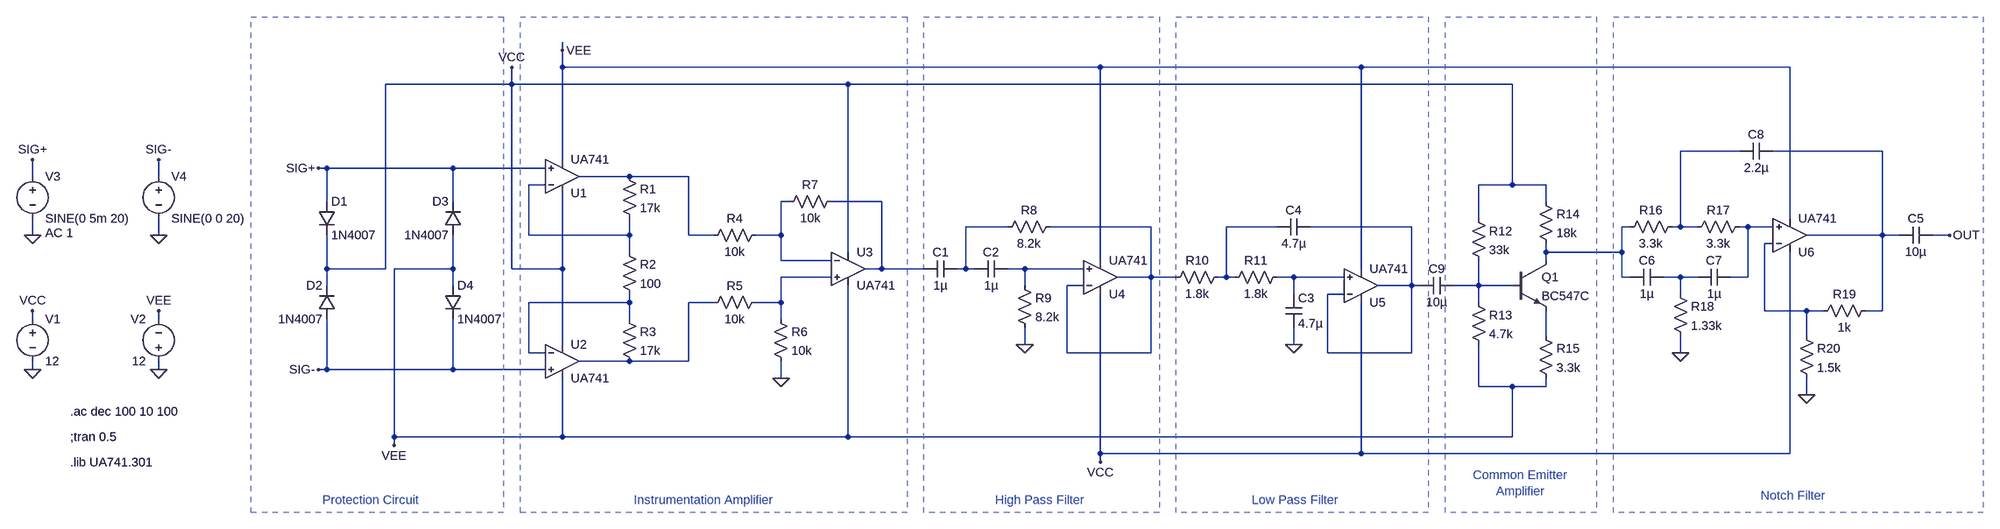
[diagram p0: schematic EEG_Final.asc]
EEG_Final.asc, the LTspice schematic file:
Version 4
SHEET 1 2916 756
WIRE 96 -128 96 -144
WIRE 96 -96 96 -128
WIRE 1120 -96 96 -96
WIRE 1616 -96 1120 -96
WIRE 2432 -96 1616 -96
WIRE 0 -64 0 -96
WIRE 0 -64 -240 -64
WIRE 640 -64 0 -64
WIRE 1904 -64 640 -64
WIRE 2336 64 2224 64
WIRE 2608 64 2400 64
WIRE 96 80 96 -96
WIRE -352 96 -368 96
WIRE -112 96 -352 96
WIRE 64 96 -112 96
WIRE -912 112 -912 80
WIRE -672 112 -672 80
WIRE 224 112 128 112
WIRE 336 112 224 112
WIRE 64 128 32 128
WIRE 1904 128 1904 -64
WIRE 1904 128 1840 128
WIRE 1968 128 1904 128
WIRE -352 160 -352 96
WIRE -112 160 -112 96
WIRE 528 160 512 160
WIRE 704 160 608 160
WIRE 1968 160 1968 128
WIRE 1840 192 1840 128
WIRE 2432 192 2432 -96
WIRE 944 208 864 208
WIRE 1216 208 1024 208
WIRE 1456 208 1360 208
WIRE 1712 208 1520 208
WIRE 2128 208 2112 208
WIRE 2224 208 2224 64
WIRE 2224 208 2208 208
WIRE 2256 208 2224 208
WIRE 2352 208 2336 208
WIRE 2400 208 2352 208
WIRE -912 224 -912 192
WIRE -672 224 -672 192
WIRE 32 224 32 128
WIRE 224 224 224 192
WIRE 224 224 32 224
WIRE 336 224 336 112
WIRE 384 224 336 224
WIRE 512 224 512 160
WIRE 512 224 464 224
WIRE 2608 224 2608 64
WIRE 2608 224 2464 224
WIRE 2640 224 2608 224
WIRE 2736 224 2704 224
WIRE 2400 240 2384 240
WIRE 224 256 224 224
WIRE 640 256 640 -64
WIRE 1968 256 1968 240
WIRE 2112 256 2112 208
WIRE 2112 256 1968 256
WIRE 512 272 512 224
WIRE 608 272 512 272
WIRE 1120 272 1120 -96
WIRE 1968 272 1968 256
WIRE -352 288 -352 224
WIRE -240 288 -240 -64
WIRE -240 288 -352 288
WIRE -112 288 -112 224
WIRE -112 288 -224 288
WIRE 0 288 0 -64
WIRE 96 288 96 144
WIRE 96 288 0 288
WIRE 704 288 704 160
WIRE 704 288 672 288
WIRE 784 288 704 288
WIRE 864 288 864 208
WIRE 864 288 848 288
WIRE 880 288 864 288
WIRE 976 288 944 288
WIRE 1088 288 976 288
WIRE 1616 288 1616 -96
WIRE 608 304 512 304
WIRE 1216 304 1216 208
WIRE 1216 304 1152 304
WIRE 1264 304 1216 304
WIRE 1360 304 1360 208
WIRE 1360 304 1344 304
WIRE 1376 304 1360 304
WIRE 1488 304 1456 304
WIRE 1584 304 1488 304
WIRE 2112 304 2112 256
WIRE 2128 304 2112 304
WIRE 2224 304 2192 304
WIRE 2256 304 2224 304
WIRE 2352 304 2352 208
WIRE 2352 304 2320 304
WIRE -352 320 -352 288
WIRE -112 320 -112 288
WIRE 976 320 976 288
WIRE 1088 320 1056 320
WIRE 1712 320 1712 208
WIRE 1712 320 1648 320
WIRE 1728 320 1712 320
WIRE 1840 320 1840 272
WIRE 1840 320 1792 320
WIRE 1904 320 1840 320
WIRE 1488 336 1488 304
WIRE 1584 336 1552 336
WIRE 2224 336 2224 304
WIRE 224 352 224 336
WIRE 224 352 32 352
WIRE 384 352 336 352
WIRE 512 352 512 304
WIRE 512 352 464 352
WIRE 1840 352 1840 320
WIRE 2384 368 2384 240
WIRE 2464 368 2384 368
WIRE 2496 368 2464 368
WIRE 2608 368 2608 224
WIRE 2608 368 2576 368
WIRE -912 384 -912 368
WIRE -672 384 -672 368
WIRE 224 384 224 352
WIRE 512 384 512 352
WIRE 1968 416 1968 368
WIRE 2464 416 2464 368
WIRE 96 432 96 288
WIRE 976 432 976 400
WIRE 1488 432 1488 400
WIRE 32 448 32 352
WIRE 64 448 32 448
WIRE 1056 448 1056 320
WIRE 1216 448 1216 304
WIRE 1216 448 1056 448
WIRE 1552 448 1552 336
WIRE 1712 448 1712 320
WIRE 1712 448 1552 448
WIRE 2224 448 2224 416
WIRE 224 464 128 464
WIRE 336 464 336 352
WIRE 336 464 224 464
WIRE -912 480 -912 464
WIRE -672 480 -672 464
WIRE -352 480 -352 384
WIRE -352 480 -368 480
WIRE -112 480 -112 384
WIRE -112 480 -352 480
WIRE 64 480 -112 480
WIRE 512 496 512 464
WIRE 1840 512 1840 432
WIRE 1904 512 1840 512
WIRE 1968 512 1968 496
WIRE 1968 512 1904 512
WIRE 2464 528 2464 496
WIRE -224 608 -224 288
WIRE 96 608 96 496
WIRE 96 608 -224 608
WIRE 640 608 640 320
WIRE 640 608 96 608
WIRE 1904 608 1904 512
WIRE 1904 608 640 608
WIRE -224 624 -224 608
WIRE 1120 640 1120 336
WIRE 1616 640 1616 352
WIRE 1616 640 1120 640
WIRE 2432 640 2432 256
WIRE 2432 640 1616 640
WIRE 1120 656 1120 640
FLAG -912 480 0
FLAG -672 480 0
FLAG -912 368 VCC
FLAG -672 368 VEE
FLAG -912 224 0
FLAG -672 224 0
FLAG -912 80 SIG+
FLAG -672 80 SIG-
FLAG -368 96 SIG+
FLAG -368 480 SIG-
FLAG 512 496 0
FLAG 976 432 0
FLAG 1488 432 0
FLAG 2224 448 0
FLAG 2464 528 0
FLAG 0 -96 VCC
FLAG -224 624 VEE
FLAG 1120 656 VCC
FLAG 96 -128 VEE
FLAG 2736 224 OUT
SYMBOL voltage -912 368 R0
SYMATTR InstName V1
SYMATTR Value 12
SYMBOL voltage -672 480 R180
WINDOW 0 24 96 Left 2
WINDOW 3 24 16 Left 2
SYMATTR InstName V2
SYMATTR Value 12
SYMBOL voltage -912 96 R0
WINDOW 123 24 124 Left 2
WINDOW 39 0 0 Left 0
SYMATTR Value2 AC 1
SYMATTR InstName V3
SYMATTR Value SINE(0 5m 20)
SYMBOL voltage -672 96 R0
WINDOW 123 0 0 Left 0
WINDOW 39 0 0 Left 0
SYMATTR InstName V4
SYMATTR Value SINE(0 0 20)
SYMBOL diode -368 160 R0
SYMATTR InstName D1
SYMATTR Value 1N4007
SYMBOL diode -336 384 R180
WINDOW 0 24 64 Left 2
WINDOW 3 24 0 Left 2
SYMATTR InstName D2
SYMATTR Value 1N4007
SYMBOL diode -96 224 R180
WINDOW 0 24 64 Left 2
WINDOW 3 24 0 Left 2
SYMATTR InstName D3
SYMATTR Value 1N4007
SYMBOL diode -128 320 R0
SYMATTR InstName D4
SYMATTR Value 1N4007
SYMBOL OpAmps\\opamp2 96 176 M180
SYMATTR InstName U1
SYMATTR Value UA741
SYMBOL res 208 96 R0
SYMATTR InstName R1
SYMATTR Value 17k
SYMBOL res 208 240 R0
SYMATTR InstName R2
SYMATTR Value 100
SYMBOL res 208 368 R0
SYMATTR InstName R3
SYMATTR Value 17k
SYMBOL OpAmps\\opamp2 96 400 R0
SYMATTR InstName U2
SYMATTR Value UA741
SYMBOL res 480 208 R90
WINDOW 0 0 56 VBottom 2
WINDOW 3 32 56 VTop 2
SYMATTR InstName R4
SYMATTR Value 10k
SYMBOL res 480 336 R90
WINDOW 0 0 56 VBottom 2
WINDOW 3 32 56 VTop 2
SYMATTR InstName R5
SYMATTR Value 10k
SYMBOL OpAmps\\opamp2 640 224 R0
SYMATTR InstName U3
SYMATTR Value UA741
SYMBOL res 496 368 R0
SYMATTR InstName R6
SYMATTR Value 10k
SYMBOL res 624 144 R90
WINDOW 0 0 56 VBottom 2
WINDOW 3 32 56 VTop 2
SYMATTR InstName R7
SYMATTR Value 10k
SYMBOL cap 848 272 R90
WINDOW 0 0 32 VBottom 2
WINDOW 3 32 32 VTop 2
SYMATTR InstName C1
SYMATTR Value 1µ
SYMBOL cap 944 272 R90
WINDOW 0 0 32 VBottom 2
WINDOW 3 32 32 VTop 2
SYMATTR InstName C2
SYMATTR Value 1µ
SYMBOL res 1040 192 R90
WINDOW 0 0 56 VBottom 2
WINDOW 3 32 56 VTop 2
SYMATTR InstName R8
SYMATTR Value 8.2k
SYMBOL res 960 304 R0
SYMATTR InstName R9
SYMATTR Value 8.2k
SYMBOL OpAmps\\opamp2 1120 368 M180
SYMATTR InstName U4
SYMATTR Value UA741
SYMBOL res 1360 288 R90
WINDOW 0 0 56 VBottom 2
WINDOW 3 32 56 VTop 2
SYMATTR InstName R10
SYMATTR Value 1.8k
SYMBOL res 1472 288 R90
WINDOW 0 0 56 VBottom 2
WINDOW 3 32 56 VTop 2
SYMATTR InstName R11
SYMATTR Value 1.8k
SYMBOL cap 1472 336 R0
SYMATTR InstName C3
SYMATTR Value 4.7µ
SYMBOL OpAmps\\opamp2 1616 384 M180
SYMATTR InstName U5
SYMATTR Value UA741
SYMBOL cap 1520 192 R90
WINDOW 0 0 32 VBottom 2
WINDOW 3 32 32 VTop 2
SYMATTR InstName C4
SYMATTR Value 4.7µ
SYMBOL npn 1904 272 R0
SYMATTR InstName Q1
SYMATTR Value BC547C
SYMBOL res 1824 176 R0
SYMATTR InstName R12
SYMATTR Value 33k
SYMBOL res 1824 336 R0
SYMATTR InstName R13
SYMATTR Value 4.7k
SYMBOL res 1952 144 R0
SYMATTR InstName R14
SYMATTR Value 18k
SYMBOL res 1952 400 R0
SYMATTR InstName R15
SYMATTR Value 3.3k
SYMBOL res 2224 192 R90
WINDOW 0 0 56 VBottom 2
WINDOW 3 32 56 VTop 2
SYMATTR InstName R16
SYMATTR Value 3.3k
SYMBOL res 2352 192 R90
WINDOW 0 0 56 VBottom 2
WINDOW 3 32 56 VTop 2
SYMATTR InstName R17
SYMATTR Value 3.3k
SYMBOL cap 2192 288 R90
WINDOW 0 0 32 VBottom 2
WINDOW 3 32 32 VTop 2
SYMATTR InstName C6
SYMATTR Value 1µ
SYMBOL cap 2320 288 R90
WINDOW 0 0 32 VBottom 2
WINDOW 3 32 32 VTop 2
SYMATTR InstName C7
SYMATTR Value 1µ
SYMBOL res 2208 320 R0
SYMATTR InstName R18
SYMATTR Value 1.33k
SYMBOL OpAmps\\opamp2 2432 288 M180
SYMATTR InstName U6
SYMATTR Value UA741
SYMBOL cap 2400 48 R90
WINDOW 0 0 32 VBottom 2
WINDOW 3 32 32 VTop 2
SYMATTR InstName C8
SYMATTR Value 2.2µ
SYMBOL res 2592 352 R90
WINDOW 0 0 56 VBottom 2
WINDOW 3 32 56 VTop 2
SYMATTR InstName R19
SYMATTR Value 1k
SYMBOL res 2448 400 R0
SYMATTR InstName R20
SYMATTR Value 1.5k
SYMBOL cap 2704 208 R90
WINDOW 0 0 32 VBottom 2
WINDOW 3 32 32 VTop 2
SYMATTR InstName C5
SYMATTR Value 10µ
SYMBOL cap 1792 304 R90
WINDOW 0 0 32 VBottom 2
WINDOW 3 32 32 VTop 2
SYMATTR InstName C9
SYMATTR Value 10µ
TEXT -840 656 Left 2 !.lib UA741.301
TEXT -840 608 Left 2 !;tran 0.5
TEXT -840 560 Left 2 !.ac dec 100 10 100
TEXT -360 728 Left 2 ;Protection Circuit
TEXT 232 728 Left 2 ;Instrumentation Amplifier
TEXT 1920 696 Center 2 ;Common Emitter\nAmplifier
TEXT 2376 720 Left 2 ;Notch Filter
TEXT 920 728 Left 2 ;High Pass Filter
TEXT 1408 728 Left 2 ;Low Pass Filter
RECTANGLE Normal -16 752 -496 -192 2
RECTANGLE Normal 16 -192 16 -192 2
RECTANGLE Normal 752 752 16 -192 2
RECTANGLE Normal 1232 752 784 -192 2
RECTANGLE Normal 1744 752 1264 -192 2
RECTANGLE Normal 2064 752 1776 -192 2
RECTANGLE Normal 2800 752 2096 -192 2

The netlist it stands for:
* EEG_Final.asc
V1 VCC 0 12
V2 0 VEE 12
V3 SIG+ 0 SINE(0 5m 20) AC 1
V4 SIG- 0 SINE(0 0 20)
D1 SIG+ VCC 1N4007
D2 SIG- VCC 1N4007
D3 VEE SIG+ 1N4007
D4 VEE SIG- 1N4007
XU1 SIG+ N004 VCC VEE N003 UA741  ; pins In+ In- V+ V- OUT
R1 N003 N004 17k
R2 N004 N019 100
R3 N019 N020 17k
XU2 SIG- N019 VCC VEE N020 UA741  ; pins In+ In- V+ V- OUT
R4 N005 N003 10k
R5 N015 N020 10k
XU3 N015 N005 VCC VEE N006 UA741  ; pins In+ In- V+ V- OUT
R6 N015 0 10k
R7 N006 N005 10k
C1 N007 N006 1µ
C2 N014 N007 1µ
R8 N008 N007 8.2k
R9 N014 0 8.2k
XU4 N014 N008 VCC VEE N008 UA741  ; pins In+ In- V+ V- OUT
R10 N009 N008 1.8k
R11 N016 N009 1.8k
C3 N016 0 4.7µ
XU5 N016 N010 VCC VEE N010 UA741  ; pins In+ In- V+ V- OUT
C4 N010 N009 4.7µ
Q1 N011 N018 N021 0 BC547C
R12 VCC N018 33k
R13 N018 VEE 4.7k
R14 VCC N011 18k
R15 N021 VEE 3.3k
R16 N001 N011 3.3k
R17 N012 N001 3.3k
C6 N017 N011 1µ
C7 N012 N017 1µ
R18 N017 0 1.33k
XU6 N012 N013 VCC VEE N002 UA741  ; pins In+ In- V+ V- OUT
C8 N002 N001 2.2µ
R19 N002 N013 1k
R20 N013 0 1.5k
C5 OUT N002 10µ
C9 N018 N010 10µ
.model D D
.lib standard.dio
.model NPN NPN
.model PNP PNP
.lib standard.bjt
.lib UA741.301
;tran 0.5
.ac dec 100 10 100
* Protection Circuit
* Instrumentation Amplifier
* Common Emitter
* Amplifier
* Notch Filter
* High Pass Filter
* Low Pass Filter
.backanno
.end